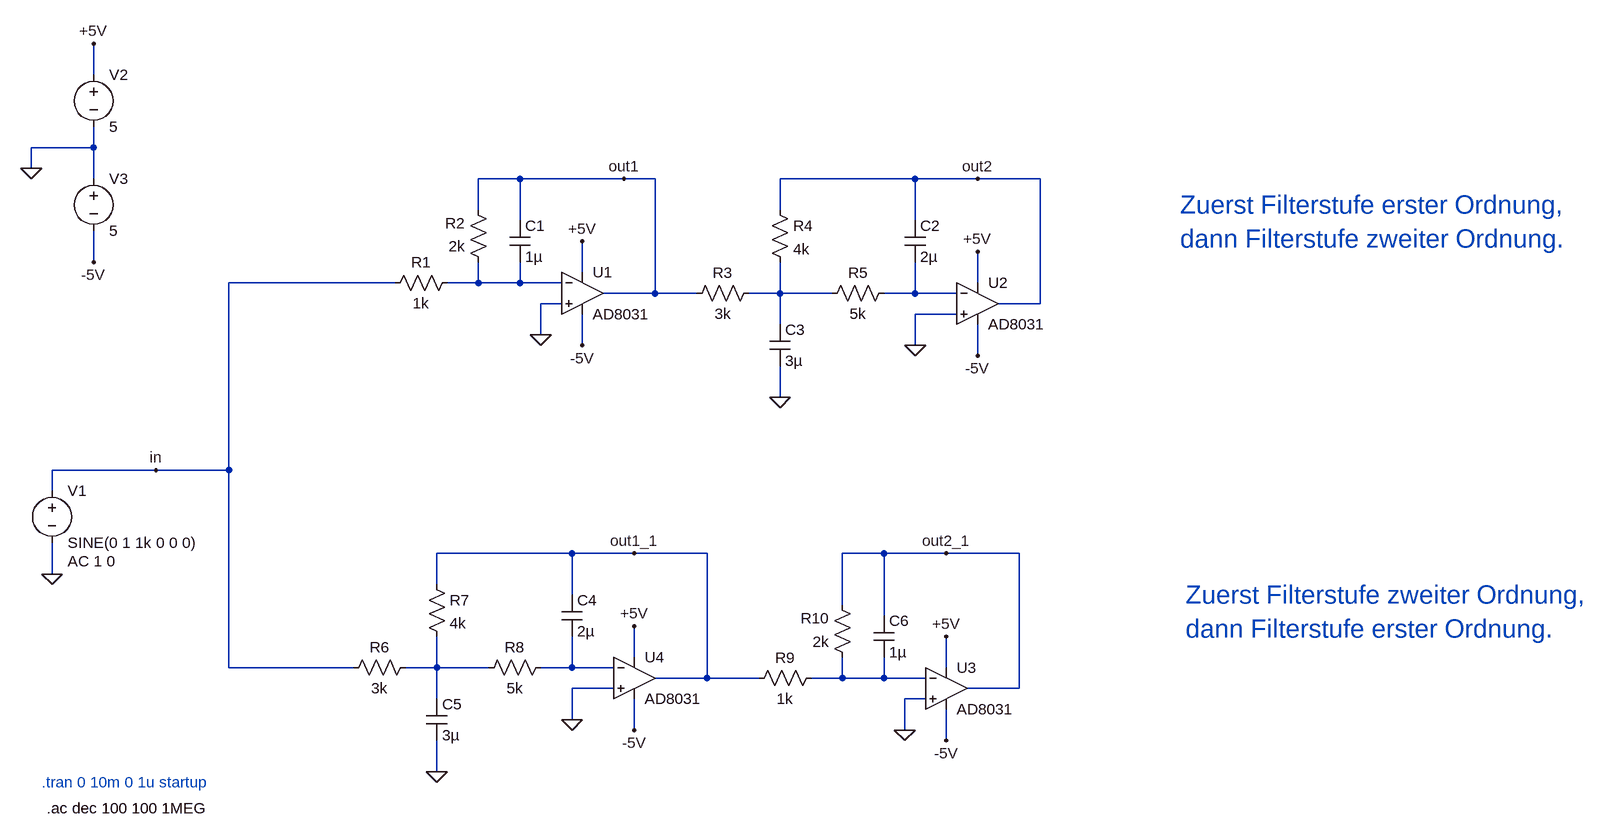
[diagram p0: schematic Tiefpass_Ordnung_3.asc]
Tiefpass_Ordnung_3.asc, the LTspice schematic file:
Version 4
SHEET 1 2400 680
WIRE -640 -464 -640 -512
WIRE -640 -352 -640 -384
WIRE -640 -352 -736 -352
WIRE -736 -320 -736 -352
WIRE -640 -304 -640 -352
WIRE 16 -304 -48 -304
WIRE 176 -304 16 -304
WIRE 224 -304 176 -304
WIRE 624 -304 416 -304
WIRE 720 -304 624 -304
WIRE 816 -304 720 -304
WIRE -48 -256 -48 -304
WIRE 416 -256 416 -304
WIRE 16 -240 16 -304
WIRE 624 -240 624 -304
WIRE -640 -176 -640 -224
WIRE 112 -160 112 -208
WIRE -176 -144 -432 -144
WIRE -48 -144 -48 -176
WIRE -48 -144 -96 -144
WIRE 16 -144 16 -176
WIRE 16 -144 -48 -144
WIRE 80 -144 16 -144
WIRE 720 -144 720 -192
WIRE 224 -128 224 -304
WIRE 224 -128 144 -128
WIRE 288 -128 224 -128
WIRE 416 -128 416 -176
WIRE 416 -128 368 -128
WIRE 496 -128 416 -128
WIRE 624 -128 624 -176
WIRE 624 -128 576 -128
WIRE 688 -128 624 -128
WIRE 80 -112 48 -112
WIRE 816 -112 816 -304
WIRE 816 -112 752 -112
WIRE 688 -96 624 -96
WIRE 416 -80 416 -128
WIRE 48 -64 48 -112
WIRE 112 -48 112 -96
WIRE 624 -48 624 -96
WIRE 720 -32 720 -80
WIRE 416 32 416 -16
WIRE -544 144 -704 144
WIRE -432 144 -432 -144
WIRE -432 144 -544 144
WIRE -704 176 -704 144
WIRE 96 272 -112 272
WIRE 192 272 96 272
WIRE 304 272 192 272
WIRE 576 272 512 272
WIRE 672 272 576 272
WIRE 784 272 672 272
WIRE -704 304 -704 256
WIRE -112 320 -112 272
WIRE 96 336 96 272
WIRE 512 352 512 272
WIRE 576 368 576 272
WIRE 192 432 192 384
WIRE -432 448 -432 144
WIRE -240 448 -432 448
WIRE -112 448 -112 400
WIRE -112 448 -160 448
WIRE -32 448 -112 448
WIRE 96 448 96 400
WIRE 96 448 48 448
WIRE 160 448 96 448
WIRE 672 448 672 400
WIRE 304 464 304 272
WIRE 304 464 224 464
WIRE 384 464 304 464
WIRE 512 464 512 432
WIRE 512 464 464 464
WIRE 576 464 576 432
WIRE 576 464 512 464
WIRE 640 464 576 464
WIRE 160 480 96 480
WIRE 784 480 784 272
WIRE 784 480 704 480
WIRE -112 496 -112 448
WIRE 640 496 608 496
WIRE 96 528 96 480
WIRE 192 544 192 496
WIRE 608 544 608 496
WIRE 672 560 672 512
WIRE -112 608 -112 560
FLAG 48 -64 0
FLAG 416 32 0
FLAG 624 -48 0
FLAG 720 -304 out2
FLAG -704 304 0
FLAG -112 608 0
FLAG 96 528 0
FLAG 608 544 0
FLAG -544 144 in
FLAG 192 272 out1_1
FLAG 672 272 out2_1
FLAG -736 -320 0
FLAG -640 -512 +5V
FLAG -640 -176 -5V
FLAG 112 -208 +5V
FLAG 720 -192 +5V
FLAG 672 400 +5V
FLAG 192 384 +5V
FLAG 192 544 -5V
FLAG 672 560 -5V
FLAG 720 -32 -5V
FLAG 112 -48 -5V
FLAG 176 -304 out1
SYMBOL res -80 -160 R90
WINDOW 0 0 56 VBottom 2
WINDOW 3 32 56 VTop 2
SYMATTR InstName R1
SYMATTR Value 1k
SYMBOL res -32 -160 R180
WINDOW 0 36 76 Left 2
WINDOW 3 36 40 Left 2
SYMATTR InstName R2
SYMATTR Value 2k
SYMBOL res 272 -112 R270
WINDOW 0 32 56 VTop 2
WINDOW 3 0 56 VBottom 2
SYMATTR InstName R3
SYMATTR Value 3k
SYMBOL res 400 -272 R0
SYMATTR InstName R4
SYMATTR Value 4k
SYMBOL res 592 -144 R90
WINDOW 0 0 56 VBottom 2
WINDOW 3 32 56 VTop 2
SYMATTR InstName R5
SYMATTR Value 5k
SYMBOL cap 0 -240 R0
SYMATTR InstName C1
SYMATTR Value 1µ
SYMBOL cap 400 -80 R0
SYMATTR InstName C3
SYMATTR Value 3µ
SYMBOL cap 608 -240 R0
SYMATTR InstName C2
SYMATTR Value 2µ
SYMBOL voltage -704 160 R0
WINDOW 123 24 124 Left 2
WINDOW 39 0 0 Left 2
SYMATTR Value2 AC 1 0
SYMATTR InstName V1
SYMATTR Value SINE(0 1 1k 0 0 0)
SYMBOL res -256 464 R270
WINDOW 0 32 56 VTop 2
WINDOW 3 0 56 VBottom 2
SYMATTR InstName R6
SYMATTR Value 3k
SYMBOL res -128 304 R0
SYMATTR InstName R7
SYMATTR Value 4k
SYMBOL res 64 432 R90
WINDOW 0 0 56 VBottom 2
WINDOW 3 32 56 VTop 2
SYMATTR InstName R8
SYMATTR Value 5k
SYMBOL cap -128 496 R0
SYMATTR InstName C5
SYMATTR Value 3µ
SYMBOL cap 80 336 R0
SYMATTR InstName C4
SYMATTR Value 2µ
SYMBOL res 480 448 R90
WINDOW 0 0 56 VBottom 2
WINDOW 3 32 56 VTop 2
SYMATTR InstName R9
SYMATTR Value 1k
SYMBOL res 528 448 R180
WINDOW 0 36 76 Left 2
WINDOW 3 36 40 Left 2
SYMATTR InstName R10
SYMATTR Value 2k
SYMBOL cap 560 368 R0
SYMATTR InstName C6
SYMATTR Value 1µ
SYMBOL voltage -640 -480 R0
WINDOW 123 0 0 Left 2
WINDOW 39 24 44 Left 2
SYMATTR InstName V2
SYMATTR Value 5
SYMBOL voltage -640 -320 R0
WINDOW 123 0 0 Left 2
WINDOW 39 0 0 Left 2
SYMATTR InstName V3
SYMATTR Value 5
SYMBOL Opamps\\AD8031 112 -192 R0
SYMATTR InstName U1
SYMBOL Opamps\\AD8031 720 -176 R0
SYMATTR InstName U2
SYMBOL Opamps\\AD8031 672 416 R0
SYMATTR InstName U3
SYMBOL Opamps\\AD8031 192 400 R0
SYMATTR InstName U4
TEXT -720 624 Left 2 ;.tran 0 10m 0 1u startup
TEXT 1032 -264 Left 4 ;Zuerst Filterstufe erster Ordnung,\ndann Filterstufe zweiter Ordnung.
TEXT 1040 336 Left 4 ;Zuerst Filterstufe zweiter Ordnung,\ndann Filterstufe erster Ordnung.
TEXT -712 664 Left 2 !.ac dec 100 100 1MEG

The netlist it stands for:
* Tiefpass_Ordnung_3.asc
R1 N001 in 1k
R2 N001 out1 2k
R3 out1 N002 3k
R4 out2 N002 4k
R5 N003 N002 5k
C1 out1 N001 1µ
C3 N002 0 3µ
C2 out2 N003 2µ
V1 in 0 SINE(0 1 1k 0 0 0) AC 1 0
R6 in N004 3k
R7 out1_1 N004 4k
R8 N005 N004 5k
C5 N004 0 3µ
C4 out1_1 N005 2µ
R9 N006 out1_1 1k
R10 N006 out2_1 2k
C6 out2_1 N006 1µ
V2 +5V 0 5
V3 0 -5V 5
XU1 0 N001 +5V -5V out1 AD8031  ; pins In+ In- V+ V- OUT
XU2 0 N003 +5V -5V out2 AD8031  ; pins In+ In- V+ V- OUT
XU3 0 N006 +5V -5V out2_1 AD8031  ; pins In+ In- V+ V- OUT
XU4 0 N005 +5V -5V out1_1 AD8031  ; pins In+ In- V+ V- OUT
* .tran 0 10m 0 1u startup
* Zuerst Filterstufe erster Ordnung,
* dann Filterstufe zweiter Ordnung.
* Zuerst Filterstufe zweiter Ordnung,
* dann Filterstufe erster Ordnung.
.ac dec 100 100 1MEG
.backanno
.end